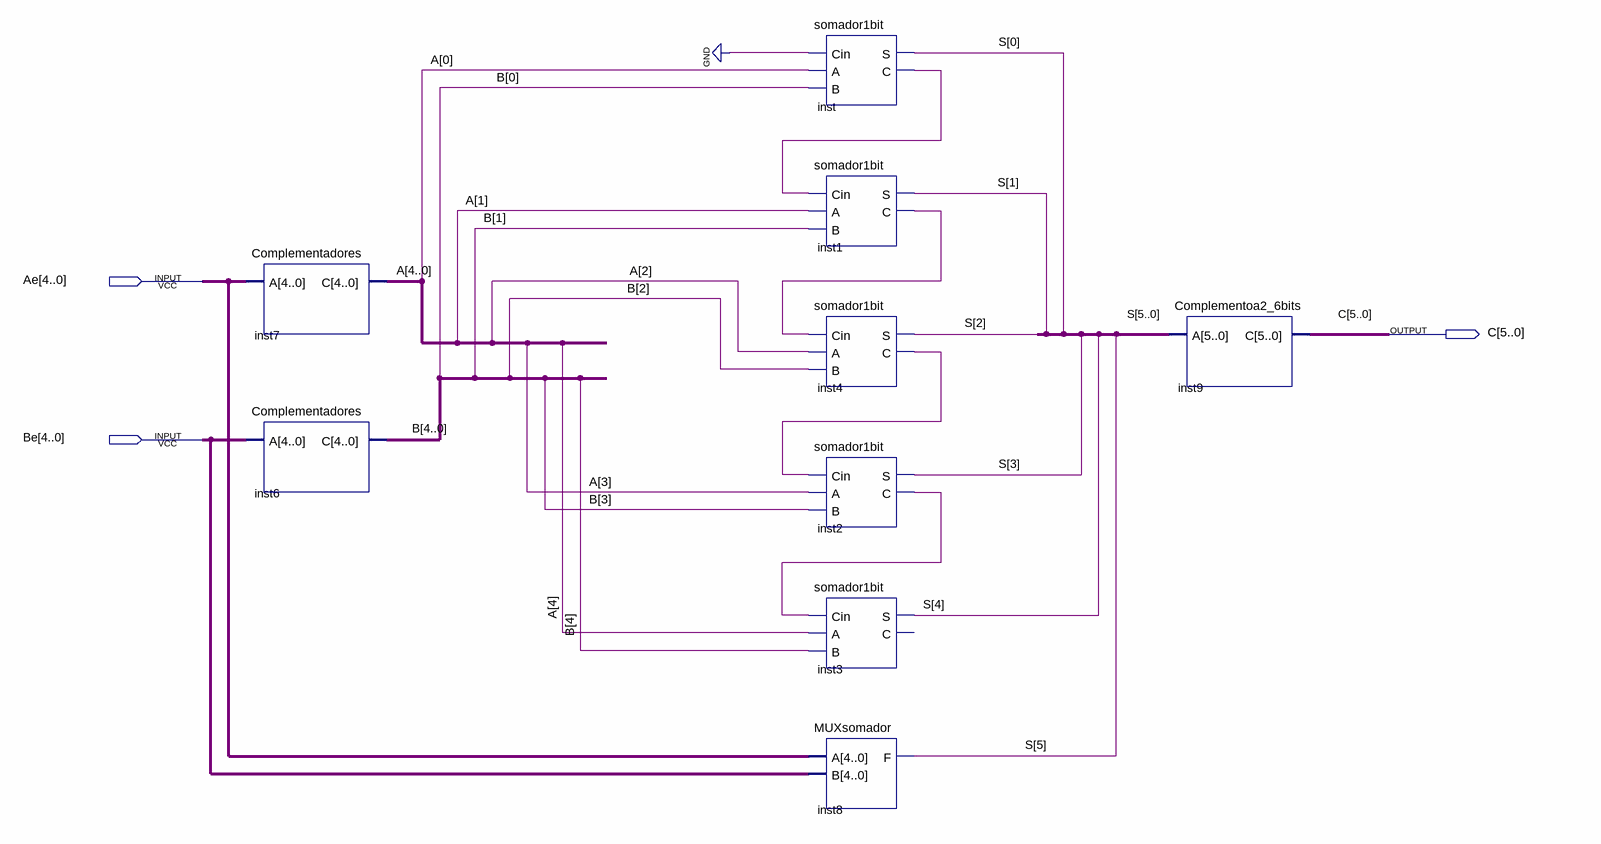
[diagram p0: schematic sheet]
// Quartus schematic teste.bdf as structural Verilog: 9 symbols, 3 pins
module teste (
  input  [4:0] Ae,
  input  [4:0] Be,
  output [5:0] C
);

  wire inst1_c, inst2_c, inst4_c, inst_c;
  wire [4:0] A, B;
  wire [5:0] S;

  Complementadores inst7 (.A(Ae), .C(A));
  Complementadores inst6 (.A(Be), .C(B));
  somador1bit inst (.Cin(1'b0), .A(A[0]), .B(B[0]), .S(S[0]), .C(inst_c));
  somador1bit inst1 (.Cin(inst_c), .A(A[1]), .B(B[1]), .S(S[1]), .C(inst1_c));
  somador1bit inst4 (.Cin(inst1_c), .A(A[2]), .B(B[2]), .S(S[2]), .C(inst4_c));
  somador1bit inst2 (.Cin(inst4_c), .A(A[3]), .B(B[3]), .S(S[3]), .C(inst2_c));
  somador1bit inst3 (.Cin(inst2_c), .A(A[4]), .B(B[4]), .S(S[4]));  // open: C
  MUXsomador inst8 (.A(Ae), .B(Be), .F(S[5]));
  Complementoa2_6bits inst9 (.A(S), .C(C));
endmodule
